# Altium project ICE_DfMux_QC.PrjPcb
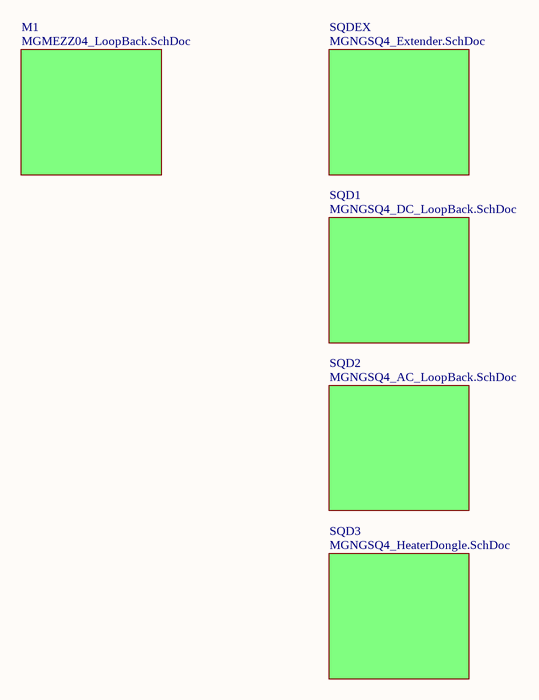
[diagram p0: ListOfDongles.SchDoc]
8 sheets, 82 parts. Net scope: flat (ports and power ports of the same name join across sheets).
Board file: ICE_DfMux_QC.PcbDoc
Sheets:
  ListOfDongles.SchDoc
    SQD3 = MGNGSQ4_HeaterDongle.SchDoc
    M1 = MGMEZZ04_LoopBack.SchDoc
    SQD2 = MGNGSQ4_AC_Loopback.SchDoc
      AC = Transformer.SchDoc
      AC = Transformer.SchDoc
      AC = Transformer.SchDoc
      AC = Transformer.SchDoc
    SQDEX = MGNGSQ4_Extender.SchDoc
    SQD1 = MGNGSQ4_DC_Loopback.SchDoc
      DC = Resistor.SchDoc
      DC = Resistor.SchDoc
      DC = Resistor.SchDoc
      DC = Resistor.SchDoc

## Sheet ListOfDongles.SchDoc
size A

### Sub-sheets
M1 = MGMEZZ04_LoopBack.SchDoc: no entries
SQD1 = MGNGSQ4_DC_LoopBack.SchDoc: no entries
SQD2 = MGNGSQ4_AC_LoopBack.SchDoc: no entries
SQD3 = MGNGSQ4_HeaterDongle.SchDoc: no entries
SQDEX = MGNGSQ4_Extender.SchDoc: no entries

## Sheet MGNGSQ4_HeaterDongle.SchDoc
size A
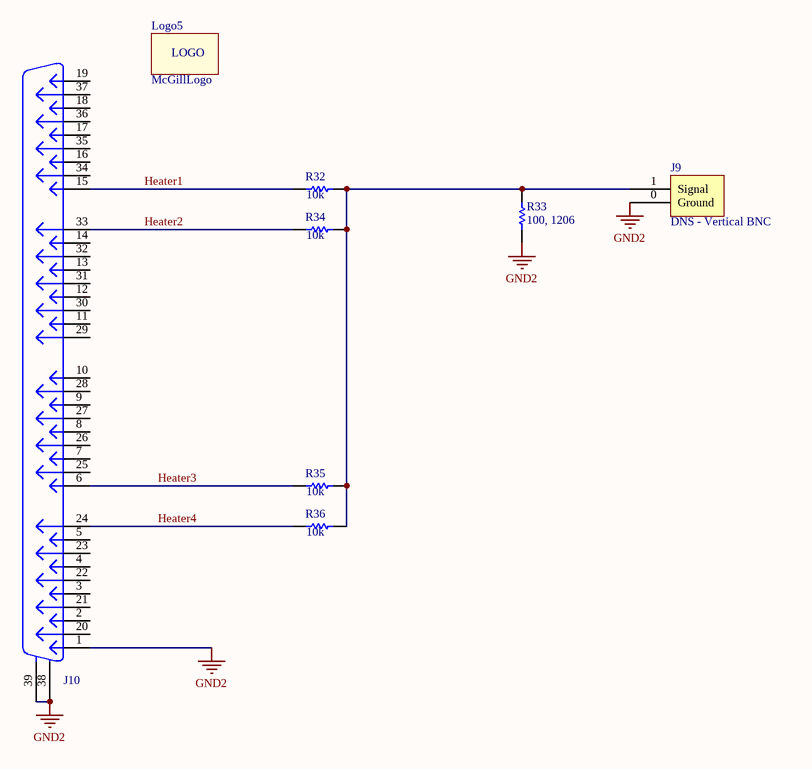
[diagram p1: MGNGSQ4_HeaterDongle.SchDoc]

### Parts
J9  DNS - Vertical BNC  [BNCVert]
J10  DB37M  [DSUB37-M]  (value not drawn)
Logo5  McGillLogo  [McGillLogo1]  (no BOM)
R32  10k  [0603]
R33  100, 1206  [1206]
R34  10k  [0603]
R35  10k  [0603]
R36  10k  [0603]

### Nets
GND2: J9.0(Ground) J10.1 J10.38(MH1) J10.39(MH2) R33.1
Heater1: J10.15 R32.1
Heater2: J10.33 R34.1
Heater3: J10.6 R35.1
Heater4: J10.24 R36.1
NetJ9_1: J9.1(Signal) R32.2 R33.2 R34.2 R35.2 R36.2

Not connected (* = marked no-connect by the designer): J10 2 3 4 5 7 8 9 10 11 12 13 14 16 17 18 19 20 21 22 23 25 26 27 28 29 30 31 32 34 35 36 37

### Notes on the sheet
- (in symbol Logo) LOGO

### Library data of the parts
J9 = BNCVertical: Vertical BNC; Manufacturer: TE Connectivity AMP Connectors; Manufacturer Part Number: 5-1634503-1; Assembly Comments: none; Value: 5-1634503-1; Supplier: Digikey; Cost: $2.79; Part Constraints: 5-1634503-1; Supplier Part Number: A97581-ND; Type: DNS
J10 = DB37M: Manufacturer: Norcomp; Part Constraints: 182-037-113R531; Assembly Comments: none; Cost: $4.32; Manufacturer Part Number: 182-037-113R531; Supplier: Digikey; Supplier Part Number: 182-37ME-ND; Value: DB37M; Type: thru-hole
Logo5 = Logo: Silkscreen Logo; Manufacturer: McGill; Assembly Comments: none; Value: McGillLogo; Cost: $0; Type: SMD
R32 R34-R36 = RES 0603: 10k Ohm RES 0603; Manufacturer: Vishay Dale; Part Constraints: RES 10k OHM 1/10W 1% 0603 SMD; Manufacturer Part Number: CRCW060310K0FKEA; Assembly Comments: none; Value: 10k; Cost: $0.124; Supplier: Digikey; Supplier Part Number: 541-10.0KHCT-ND; Type: SMD
R33 = RES 1206: 100 Ohm RES 1/4W 1206 SMD; Manufacturer: Rohm Semiconductor; Part constraints: 100 Ohm, 1206, 100ppm, 1%, 1/3W; Manufacturer Part Number: ESR18EZPF1000; Value: 100; Assembly Comments: none; Supplier: Digikey; Cost: $0.21; Supplier Part Number: RHM100AFCT-ND; Type: SMD

## Sheet MGMEZZ04_LoopBack.SchDoc
size Letter
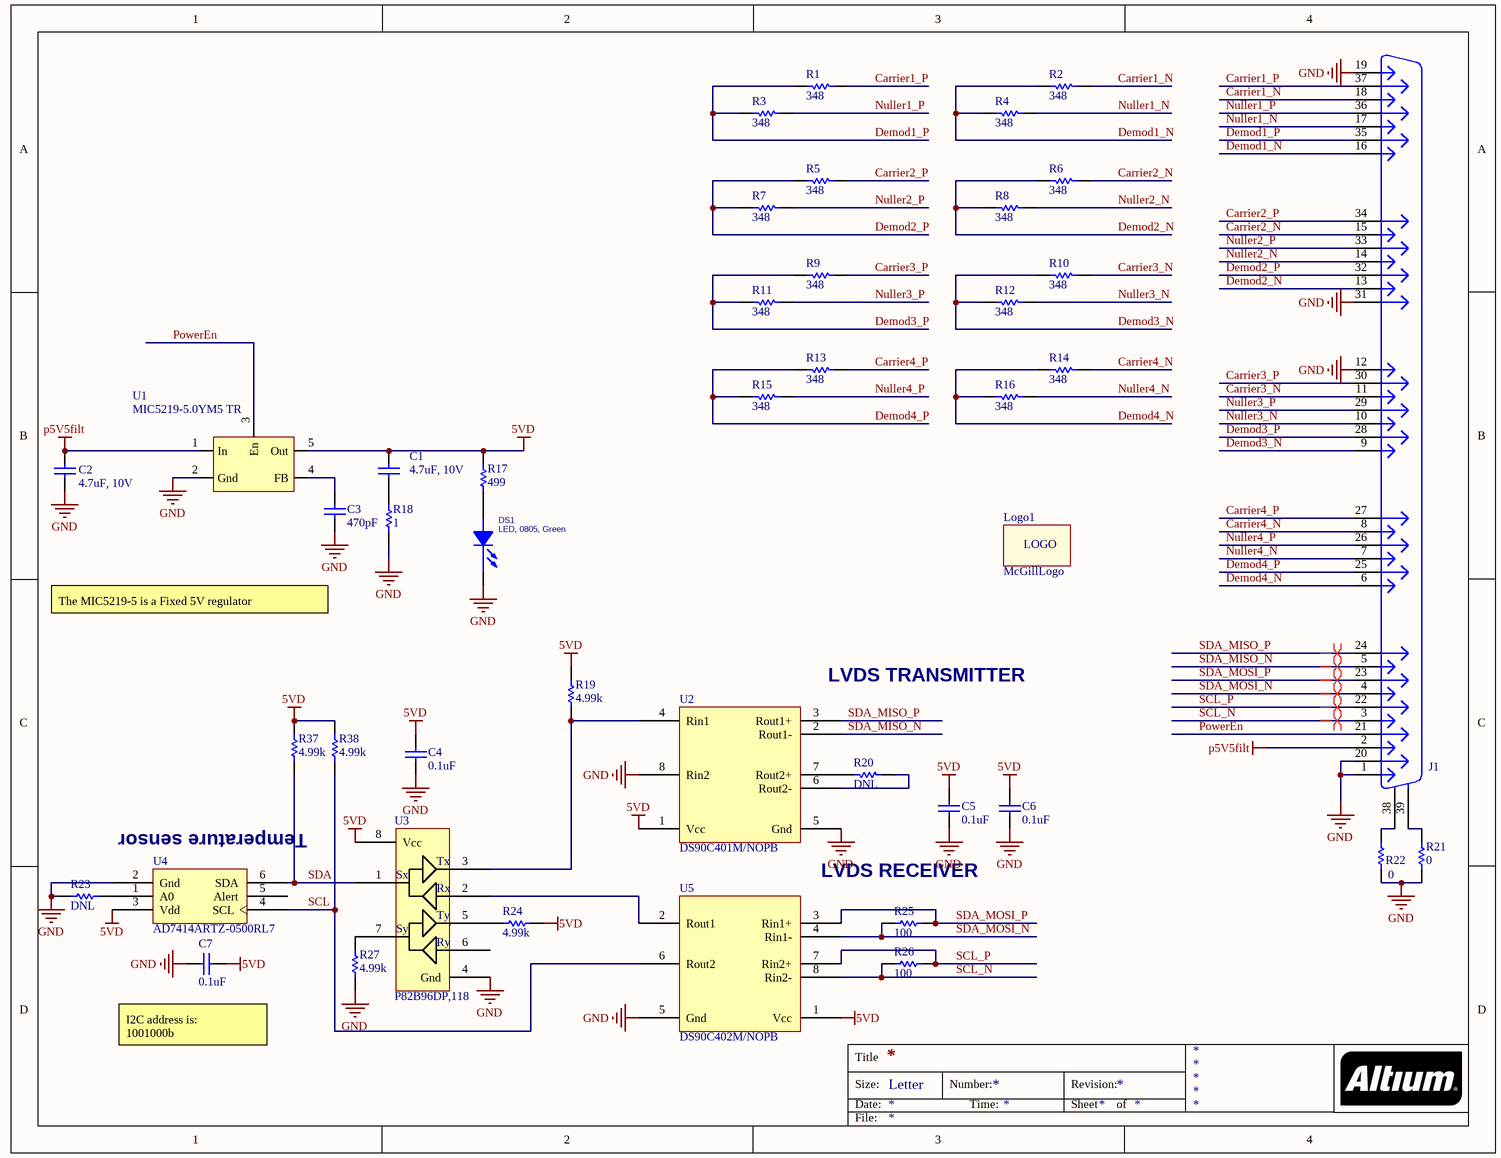
[diagram p2: MGMEZZ04_LoopBack.SchDoc]

### Parts
C1  4.7uF, 10V  [0805]
C2  4.7uF, 10V  [0805]
C3  470pF  [0603]
C4  0.1uF  [0603]
C5  0.1uF  [0603]
C6  0.1uF  [0603]
C7  0.1uF  [0603]
DS1  LED, 0805, Green  [0805L]
J1  DB37M  [DSUB37-M]  (value not drawn)
Logo1  McGillLogo  [McGillLogo1]  (no BOM)
R1  348  [0603]
R2  348  [0603]
R3  348  [0603]
R4  348  [0603]
R5  348  [0603]
R6  348  [0603]
R7  348  [0603]
R8  348  [0603]
R9  348  [0603]
R10  348  [0603]
R11  348  [0603]
R12  348  [0603]
R13  348  [0603]
R14  348  [0603]
R15  348  [0603]
R16  348  [0603]
R17  499  [0603]
R18  1  [0603]
R19  4.99k  [0603]
R20  DNL  [0603]
R21  0  [0603]
R22  0  [0603]
R23  DNL  [0603]
R24  4.99k  [0603]
R25  100  [0603]
R26  100  [0603]
R27  4.99k  [0603]
R37  4.99k  [0603]
R38  4.99k  [0603]
U1  MIC5219-5.0YM5 TR  [SOT23-5]
U2  DS90C401M/NOPB  [SO8]
U3  P82B96DP,118  [MSOP8-P82B96]
U4  AD7414ARTZ-0500RL7  [SOT23-6]
U5  DS90C402M/NOPB  [SO8]

### Nets
5VD: C1.2 C4.2 C5.2 C6.2 C7.2 R17.1 R19.2 R24.2 R37.2 R38.2 U1.5(Out) U2.1(Vcc) U3.8(Vcc) U4.3(Vdd) U5.1(Vcc)
GND: C2.1 C3.1 C4.1 C5.1 C6.1 C7.1 DS1.2(CATHODE) J1.1 J1.12 J1.19 J1.20 J1.31 R18.1 R21.2 R22.1 R23.2 R27.1 U1.2(Gnd) U2.5(Gnd) U2.8(Rin2) U3.4(Gnd) U4.2(Gnd) U5.5(Gnd)
p5V5filt: C2.2 J1.2 U1.1(In)
Carrier1_N: J1.18 R2.2
Carrier1_P: J1.37 R1.2
Carrier2_N: J1.15 R6.2
Carrier2_P: J1.34 R5.2
Carrier3_N: J1.11 R10.2
Carrier3_P: J1.30 R9.2
Carrier4_N: J1.8 R14.2
Carrier4_P: J1.27 R13.2
Demod1_N: J1.16 R2.1 R4.1
Demod1_P: J1.35 R1.1 R3.1
Demod2_N: J1.13 R6.1 R8.1
Demod2_P: J1.32 R5.1 R7.1
Demod3_N: J1.9 R10.1 R12.1
Demod3_P: J1.28 R9.1 R11.1
Demod4_N: J1.6 R14.1 R16.1
Demod4_P: J1.25 R13.1 R15.1
Nuller1_N: J1.17 R4.2
Nuller1_P: J1.36 R3.2
Nuller2_N: J1.14 R8.2
Nuller2_P: J1.33 R7.2
Nuller3_N: J1.10 R12.2
Nuller3_P: J1.29 R11.2
Nuller4_N: J1.7 R16.2
Nuller4_P: J1.26 R15.2
PowerEn: J1.21 U1.3(En)
SCL: R38.1 U4.4(SCL) U5.6(Rout2)
SCL_N: J1.3 R26.1 U5.8(Rin2-)
SCL_P: J1.22 R26.2 U5.7(Rin2+)
SDA: R37.1 U3.1(Sx) U4.6(SDA)
SDA_MISO_N: J1.5 U2.2(Rout1-)
SDA_MISO_P: J1.24 U2.3(Rout1+)
SDA_MOSI_N: J1.4 R25.1 U5.4(Rin1-)
SDA_MOSI_P: J1.23 R25.2 U5.3(Rin1+)
NetC1_1: C1.1 R18.2
NetC3_2: C3.2 U1.4(FB)
NetDS1_1: DS1.1(ANODE) R17.2
NetJ1_38: J1.38(MH1) R22.2
NetJ1_39: J1.39(MH2) R21.1
NetR19_1: R19.1 U2.4(Rin1) U3.3(Tx)
NetR20_1: R20.1 U2.6(Rout2-)
NetR20_2: R20.2 U2.7(Rout2+)
NetR23_1: R23.1 U4.1(A0)
NetR24_1: R24.1 U3.5(Ty)
NetR27_2: R27.2 U3.7(Sy)
NetU3_2: U3.2(Rx) U5.2(Rout1)

Not connected (* = marked no-connect by the designer): U3 6(Ry); U4 5(Alert)

### Layout directives
differential pair: SCL_N, SCL_P, SDA_MISO_N, SDA_MISO_P, SDA_MOSI_N, SDA_MOSI_P

### Notes on the sheet
- The MIC5219-5 is a Fixed 5V regulator
- (near U2) LVDS TRANSMITTER
- (near U4) Temperature sensor
- LVDS RECEIVER
- (near C7) I2C address is:
  1001000b
- Labels drawn without touching a wire or pin: SCL
- Title
- Size:
- Date:
- Letter
- Number:
- Time:
- Revision:
- Sheet
- of
- File:
- (in symbol Logo) LOGO

### Library data of the parts
C1 C2 = CAP 0805: 4.7uF 10V Capacitor, Ceramic, 0805; Manufacturer: Taiyo Yuden; Part Constraints: LMK212BJ475KD-T; Assembly Comments: none; Type: SMD; Value: 4.7uF, 10V; Supplier: Digikey; Supplier Part Number: 587-1297-1-ND; Manufacturer Part Number: LMK212BJ475KD-T; Cost: $0.24
C3 = Cap0603: 470pF Capacitor, Ceramic, 0603; Part Constraints: 470pF 50V 10% X7R 0603; Manufacturer: Kemet; Manufacturer Part Number: C0603C471K5RACTU; Assembly Comments: none; Type: SMD; Value: 470pF; Supplier: Digikey; Supplier Part Number: 399-1075-1-ND; Cost: $0.14
C4-C7 = Cap0603: 0.1uF 0603 Ceramic Capacitor; Part Constraints: 0.1uF 16V 10% X7R; Manufacturer: Kemet; Manufacturer Part Number: C0603C104K4RACTU; Assembly Comments: none; Type: SMD; Value: 0.1uF; Supplier: Digikey; Supplier Part Number: 399-1096-1-ND; Cost: $0.14
DS1 = LED: LED GREEN CLEAR 0805 SMD; Manufacturer: Lite-On Inc; Part constraints: Green LED 0805 2.1V forward voltage 6mcd 10mA; Manufacturer Part Number: LTST-C170GKT; Assembly Comments: none; Supplier: Digikey; Supplier Part Number: 160-1179-1-ND; Value: LED, 0805, Green; Cost: $0.49; Type: SMD
J1 = DB37M: as J10 on sheet MGNGSQ4_HeaterDongle; Supplier: Digikey; Supplier Part Number: 182-37ME-ND; Value: DB37M; Manufacturer Part Number: 182-037-113R531; Cost: $4.32; Type: thru-hole
Logo1 = Logo: as Logo5 on sheet MGNGSQ4_HeaterDongle; Value: McGillLogo; Cost: $0; Type: SMD
R1-R16 = Res0603: 348 Ohm RES 0603; Manufacturer: Vishay Dale; Part constraints: RES 348 OHM 1/10W 1% 0603 SMD; Manufacturer Part Number: CRCW0603348RFKEA; Assembly Comments: none; Value: 348; Supplier: Digikey; Supplier Part Number: 541-348HCT-ND; Cost: $0.124; Type: SMD
R17 = RES 0603: 499 Ohm RES 0603; Manufacturer: Vishay Dale; Part constraints: RES 499 OHM 1/10W 1% 0603 SMD; Manufacturer Part Number: CRCW0603499RFKEA; Assembly Comments: none; Value: 499; Supplier: Digikey; Supplier Part Number: 541-499HCT-ND; Cost: $0.124; Type: SMD
R18 = Res0603: 1 Ohm RES 0603; Manufacturer: Vishay Dale; Part constraints: RES 1 OHM 1/10W 1% 0603 SMD; Manufacturer Part Number: CRCW06031R00FKEA; Assembly Comments: none; Value: 1; Supplier: Digikey; Supplier Part Number: 541-1.00HHCT-ND; Cost: $0.124; Type: SMD
R19 R24 R27 R37 R38 = Res0603: 4.99k Ohm RES 0603; Manufacturer: Vishay Dale; Part constraints: RES 4.99K OHM 1/10W 1% 0603 SMD; Manufacturer Part Number: CRCW06034K99FKEA; Assembly Comments: none; Value: 4.99k; Supplier: Digikey; Supplier Part Number: 541-4.99KHCT-ND; Cost: $0.124; Type: SMD
R20 R23 = Res0603: DO NOT LOAD (DNS); Manufacturer: Generic; Assembly Comments: none; Value: DNL; Part constraints: DNL; Supplier: Digikey; Manufacturer Part Number: DNL; Cost: $0; Type: DNS
R21 R22 = RES 0603: 0 Ohm RES 0603; Manufacturer: Vishay Dale; Part constraints: 0 1/10W 1% 100ppm/C 0603; Manufacturer Part Number: CRCW06030000Z0EA; Assembly Comments: none; Value: 0; Supplier: Digikey; Supplier Part Number: 541-0.0GCT-ND; Cost: $0.114; Type: SMD
R25 R26 = RES 0603: 100 Ohm RES 0603; Manufacturer: Vishay Dale; Part constraints: RES 100 OHM 1/10W 1% 0603 SMD; Manufacturer Part Number: CRCW0603100RFKEA; Assembly Comments: none; Value: 100; Supplier: Digikey; Supplier Part Number: 541-100HCT-ND; Cost: $0.124; Type: SMD
U1 = TPS73601DBVR: Adjustable 30uVrms noise 400mA regulator; Manufacturer: Micrel Inc; Assembly Comments: none; Part Constraints: MIC5219-5.0YM5 TR; Supplier: Digikey; Supplier Part Number: 576-2770-1-ND; Value: MIC5219-5.0YM5 TR; Manufacturer Part Number: MIC5219-5.0YM5 TR; Cost: $2.62; Type: SMD
U2 = DS90C401M/NOPB: IC DRV LVDS DUAL DIFF SGNL 8SOIC; Manufacturer: Texas Instruments; Part Constraints: DS90C401MX/NOPB; Assembly Comments: none; Supplier: Digikey; Supplier Part Number: DS90C401M/NOPB-ND; Value: DS90C401M/NOPB; Manufacturer Part Number: DS90C401MX/NOPB; Cost: $4.64; Type: SMD
U3 = P82B96: IC DUAL BI-DIR BUS BUFFER 8-TSSOP; Assembly Comments: none; Part Constraints: P82B96DP,118; Supplier: Digikey; Supplier Part Number: 568-3197-1-ND; Value: P82B96DP,118; Manufacturer Part Number: P82B96DP,118; Cost: $4.61; Type: SMD
U4 = AD7414ARTZ-0500RL7: Digital Temperature Sensor, 11-Bit, +/-2 Degree Accurate; Manufacturer: Analog Devices; Assembly Comments: none; Footprint: *; Part constraints: AD7414ARTZ-0500RL7; Supplier: Digikey; Supplier Part Number: AD7414ARTZ0500RCT-ND; Value: AD7414ARTZ-0500RL7; Manufacturer Part Number: AD7414ARTZ-0500RL7; Cost: $4.11; Type: SMD
U5 = DS90C402M/NOPB: IC REC LVDS DUAL DIFF SGNL 8SOIC; Manufacturer: Texas Instruments; Part Constraints: DS90C402MX/NOPB; Assembly Comments: none; Supplier: Digikey; Supplier Part Number: DS90C402M/NOPB-ND; Value: DS90C402M/NOPB; Manufacturer Part Number: DS90C402MX/NOPB; Cost: $5.16; Type: SMD

## Sheet MGNGSQ4_AC_Loopback.SchDoc
size A
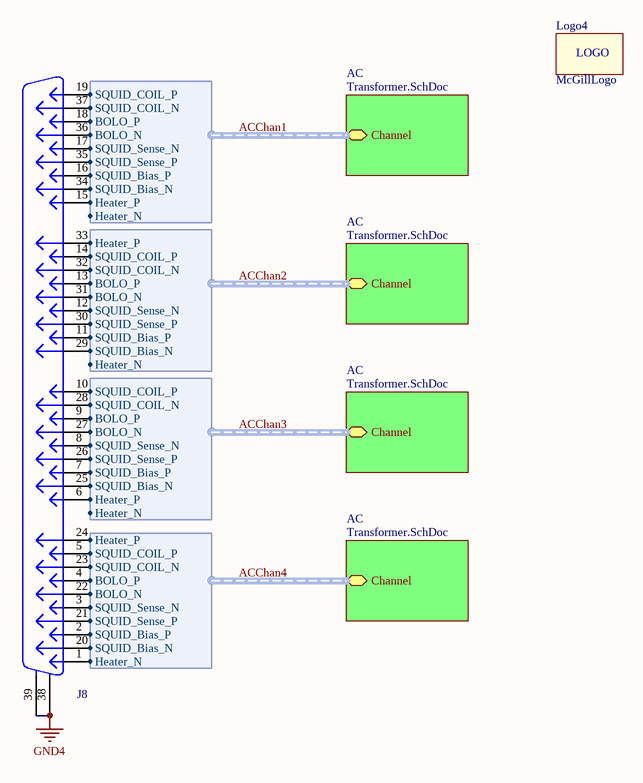
[diagram p3: MGNGSQ4_AC_Loopback.SchDoc]

### Parts
J8  DB37M  [DSUB37-M]  (value not drawn)
Logo4  McGillLogo  [McGillLogo1]  (no BOM)

### Sub-sheets
AC = Transformer.SchDoc: Channel (harness SQUID_CH_IN)
AC = Transformer.SchDoc: Channel (harness SQUID_CH_IN)
AC = Transformer.SchDoc: Channel (harness SQUID_CH_IN)
AC = Transformer.SchDoc: Channel (harness SQUID_CH_IN)

### Harnesses
SQUID_CH_IN: SQUID_COIL_P, SQUID_COIL_N, BOLO_P, BOLO_N, SQUID_Sense_P, SQUID_Bias_P, SQUID_Bias_N, Heater_P, SQUID_Sense_N, Heater_N

### Nets
GND4: J8.38(MH1) J8.39(MH2)
ACChan1.BOLO_N: J8.36 ; sheet AC/Channel.BOLO_N
ACChan1.BOLO_P: J8.18 ; sheet AC/Channel.BOLO_P
ACChan1.Heater_P: J8.15 ; sheet AC/Channel.Heater_P
ACChan1.SQUID_Bias_N: J8.34 ; sheet AC/Channel.SQUID_Bias_N
ACChan1.SQUID_Bias_P: J8.16 ; sheet AC/Channel.SQUID_Bias_P
ACChan1.SQUID_COIL_N: J8.37 ; sheet AC/Channel.SQUID_COIL_N
ACChan1.SQUID_COIL_P: J8.19 ; sheet AC/Channel.SQUID_COIL_P
ACChan1.SQUID_Sense_N: J8.17 ; sheet AC/Channel.SQUID_Sense_N
ACChan1.SQUID_Sense_P: J8.35 ; sheet AC/Channel.SQUID_Sense_P
ACChan2.BOLO_N: J8.31 ; sheet AC/Channel.BOLO_N
ACChan2.BOLO_P: J8.13 ; sheet AC/Channel.BOLO_P
ACChan2.Heater_P: J8.33 ; sheet AC/Channel.Heater_P
ACChan2.SQUID_Bias_N: J8.29 ; sheet AC/Channel.SQUID_Bias_N
ACChan2.SQUID_Bias_P: J8.11 ; sheet AC/Channel.SQUID_Bias_P
ACChan2.SQUID_COIL_N: J8.32 ; sheet AC/Channel.SQUID_COIL_N
ACChan2.SQUID_COIL_P: J8.14 ; sheet AC/Channel.SQUID_COIL_P
ACChan2.SQUID_Sense_N: J8.12 ; sheet AC/Channel.SQUID_Sense_N
ACChan2.SQUID_Sense_P: J8.30 ; sheet AC/Channel.SQUID_Sense_P
ACChan3.BOLO_N: J8.27 ; sheet AC/Channel.BOLO_N
ACChan3.BOLO_P: J8.9 ; sheet AC/Channel.BOLO_P
ACChan3.Heater_P: J8.6 ; sheet AC/Channel.Heater_P
ACChan3.SQUID_Bias_N: J8.25 ; sheet AC/Channel.SQUID_Bias_N
ACChan3.SQUID_Bias_P: J8.7 ; sheet AC/Channel.SQUID_Bias_P
ACChan3.SQUID_COIL_N: J8.28 ; sheet AC/Channel.SQUID_COIL_N
ACChan3.SQUID_COIL_P: J8.10 ; sheet AC/Channel.SQUID_COIL_P
ACChan3.SQUID_Sense_N: J8.8 ; sheet AC/Channel.SQUID_Sense_N
ACChan3.SQUID_Sense_P: J8.26 ; sheet AC/Channel.SQUID_Sense_P
ACChan4.BOLO_N: J8.22 ; sheet AC/Channel.BOLO_N
ACChan4.BOLO_P: J8.4 ; sheet AC/Channel.BOLO_P
ACChan4.Heater_N: J8.1 ; sheet AC/Channel.Heater_N
ACChan4.Heater_P: J8.24 ; sheet AC/Channel.Heater_P
ACChan4.SQUID_Bias_N: J8.20 ; sheet AC/Channel.SQUID_Bias_N
ACChan4.SQUID_Bias_P: J8.2 ; sheet AC/Channel.SQUID_Bias_P
ACChan4.SQUID_COIL_N: J8.23 ; sheet AC/Channel.SQUID_COIL_N
ACChan4.SQUID_COIL_P: J8.5 ; sheet AC/Channel.SQUID_COIL_P
ACChan4.SQUID_Sense_N: J8.3 ; sheet AC/Channel.SQUID_Sense_N
ACChan4.SQUID_Sense_P: J8.21 ; sheet AC/Channel.SQUID_Sense_P

### Buses and harness runs
harness ACChan1 = sheet AC/Channel
harness ACChan2 = sheet AC/Channel
harness ACChan3 = sheet AC/Channel
harness ACChan4 = sheet AC/Channel

### Notes on the sheet
- (in symbol Logo) LOGO

### Library data of the parts
J8 = DB37M: as J10 on sheet MGNGSQ4_HeaterDongle; Cost: $4.32; Manufacturer Part Number: 182-037-113R531; Supplier: Digikey; Supplier Part Number: 182-37ME-ND; Value: DB37M; Type: thru-hole
Logo4 = Logo: as Logo5 on sheet MGNGSQ4_HeaterDongle; Value: McGillLogo; Cost: $0; Type: SMD

## Sheet Transformer.SchDoc
size A
Used 4 times, as channels SQD2/AC, SQD2/AC, SQD2/AC, SQD2/AC. Parts and nets are listed once, with the designators drawn on the sheet.
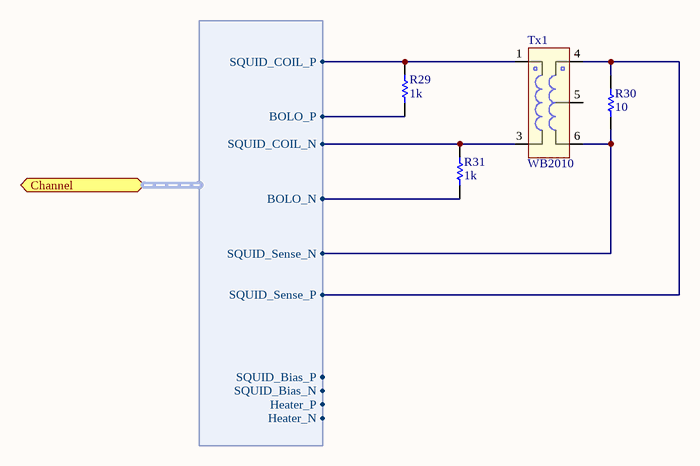
[diagram p4: Transformer.SchDoc]

### Parts
R29  1k  [0603]
R30  10  [0603]
R31  1k  [0603]
Tx1  WB2010  [WB2010]

### Ports
Channel (harness SQUID_CH_IN)

### Harnesses
SQUID_CH_IN: SQUID_COIL_P, SQUID_COIL_N, BOLO_P, BOLO_N, SQUID_Sense_P, SQUID_Bias_P, SQUID_Bias_N, Heater_P, SQUID_Sense_N, Heater_N

### Nets
NetR29_1: R29.1 ; port Channel.BOLO_P
NetR29_2: R29.2 Tx1.1 ; port Channel.SQUID_COIL_P
NetR30_1: R30.1 Tx1.6 ; port Channel.SQUID_Sense_N
NetR30_2: R30.2 Tx1.4 ; port Channel.SQUID_Sense_P
NetR31_1: R31.1 ; port Channel.BOLO_N
NetR31_2: R31.2 Tx1.3 ; port Channel.SQUID_COIL_N

Not connected (* = marked no-connect by the designer): Tx1 5

### Channels
SQD2/AC: designators end in _AC4
SQD2/AC: designators end in _AC3
SQD2/AC: designators end in _AC2
SQD2/AC: designators end in _AC1

### Library data of the parts
R29 R31 = RES 0603: 1k RES 0603; Manufacturer: Vishay Dale; Part Constraints: RES 1k OHM 1/10W 1% 0603 SMD; Manufacturer Part Number: CRCW06031K00FKEA; Assembly Comments: none; Value: 1k; Cost: $0.124; Supplier: Digikey; Supplier Part Number: 541-1.00KHCT-ND; Type: SMD
R30 = RES 0603: 10 Ohm RES 0603; Manufacturer: Vishay Dale; Part Constraints: RES 10 OHM 1/10W 1% 0603 SMD; Manufacturer Part Number: CRCW060310R0FKEA; Assembly Comments: none; Value: 10; Cost: $0.124; Supplier: Digikey; Supplier Part Number: 541-10.0HCT-ND; Type: SMD
Tx1 = WB2010: WB2010 1:1 Transformer; Manufacturer: Coilcraft; Manufacturer Part Number: WB2010-SMLB; Assembly Comments: none; Value: WB2010-SMLB; Supplier: Coilcraft; Cost: $4.16; Part Constraints: WB2010-SMLB; Supplier Part Number: WB2010-SMLB; Type: SMD

## Sheet MGNGSQ4_Extender.SchDoc
size A
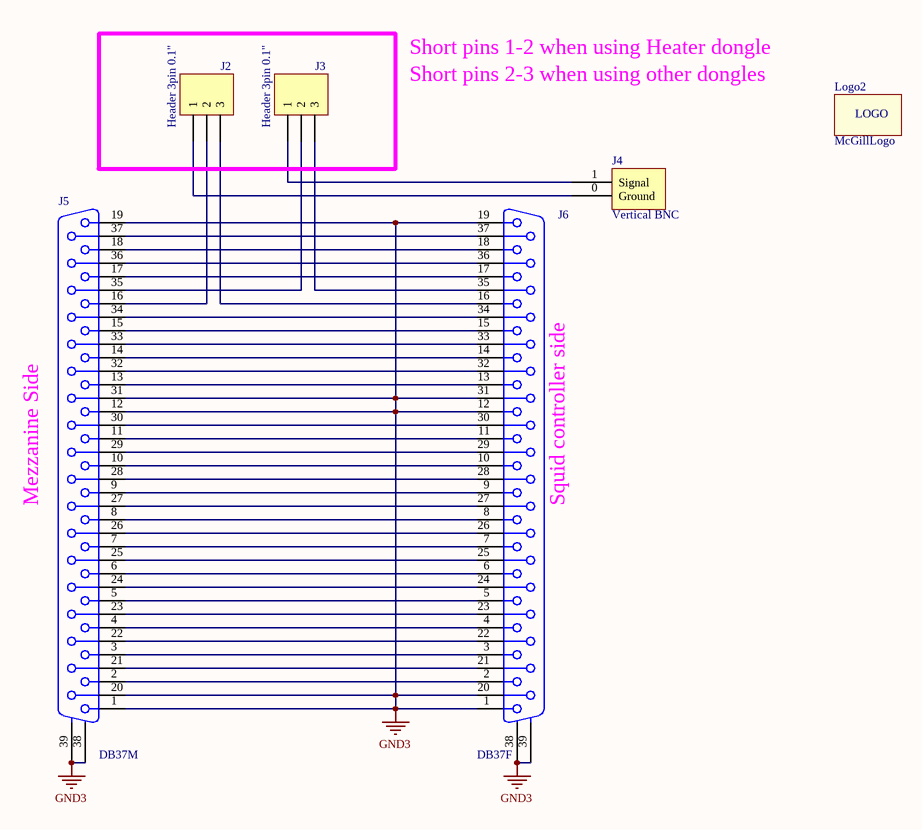
[diagram p5: MGNGSQ4_Extender.SchDoc]

### Parts
J2  Header 3pin 0.1"  [HDR1X3]
J3  Header 3pin 0.1"  [HDR1X3]
J4  Vertical BNC  [BNCVert]
J5  DB37M  [DSUB37-M]
J6  DB37F  [DSUB37-F]
Logo2  McGillLogo  [McGillLogo1]  (no BOM)

### Nets
GND3: J5.1 J5.12 J5.19 J5.20 J5.31 J5.38(MH1) J5.39(MH2) J6.1 J6.12 J6.19 J6.20 J6.31 J6.38(MH1) J6.39(MH2)
NetJ2_1: J2.1 J4.0(Ground)
NetJ2_2: J2.2 J5.16
NetJ2_3: J2.3 J6.16
NetJ3_1: J3.1 J4.1(Signal)
NetJ3_2: J3.2 J5.35
NetJ3_3: J3.3 J6.35
NetJ5_2: J5.2 J6.2
NetJ5_3: J5.3 J6.3
NetJ5_4: J5.4 J6.4
NetJ5_5: J5.5 J6.5
NetJ5_6: J5.6 J6.6
NetJ5_7: J5.7 J6.7
NetJ5_8: J5.8 J6.8
NetJ5_9: J5.9 J6.9
NetJ5_10: J5.10 J6.10
NetJ5_11: J5.11 J6.11
NetJ5_13: J5.13 J6.13
NetJ5_14: J5.14 J6.14
NetJ5_15: J5.15 J6.15
NetJ5_17: J5.17 J6.17
NetJ5_18: J5.18 J6.18
NetJ5_21: J5.21 J6.21
NetJ5_22: J5.22 J6.22
NetJ5_23: J5.23 J6.23
NetJ5_24: J5.24 J6.24
NetJ5_25: J5.25 J6.25
NetJ5_26: J5.26 J6.26
NetJ5_27: J5.27 J6.27
NetJ5_28: J5.28 J6.28
NetJ5_29: J5.29 J6.29
NetJ5_30: J5.30 J6.30
NetJ5_32: J5.32 J6.32
NetJ5_33: J5.33 J6.33
NetJ5_34: J5.34 J6.34
NetJ5_36: J5.36 J6.36
NetJ5_37: J5.37 J6.37

### Notes on the sheet
- Short pins 1-2 when using Heater dongle
- (near Logo2) Short pins 2-3 when using other dongles
- (near J5) Mezzanine Side
- (near J6) Squid controller side
- (in symbol Logo) LOGO

### Library data of the parts
J2 J3 = Header3: Header, 0.1", 3-Pin straight; Manufacturer: Digikey; Manufacturer Part Number: 961103-6404-AR; Part Constraints: 3 pin 100mil header; Assembly Comments: none; Footprint: *; Supplier: Digikey; Cost: $0.37; Supplier Part Number: 3M9448-ND; Type: thru-hole
J4 = BNCVertical: Manufacturer: TE Connectivity AMP Connectors; Manufacturer Part Number: 5-1634503-1; Assembly Comments: none; Value: 5-1634503-1; Supplier: Digikey; Cost: $2.79; Part Constraints: 5-1634503-1; Supplier Part Number: A97581-ND; Type: thru-hole
J5 = DB37M: as J10 on sheet MGNGSQ4_HeaterDongle; Cost: $4.32; Manufacturer Part Number: 182-037-113R531; Supplier: Digikey; Supplier Part Number: 182-37ME-ND; Value: DB37M; Type: thru-hole
J6 = DB37F: Manufacturer: Norcomp; Part Constraints: 182-037-213R181; Assembly Comments: none; Cost: $4.97; Manufacturer Part Number: 182-037-213R181; Supplier: Digikey; Supplier Part Number: 182-837FE-ND; Value: DB37F; Type: thru-hole
Logo2 = Logo: as Logo5 on sheet MGNGSQ4_HeaterDongle; Value: McGillLogo; Cost: $0; Type: SMD

## Sheet MGNGSQ4_DC_Loopback.SchDoc
size A
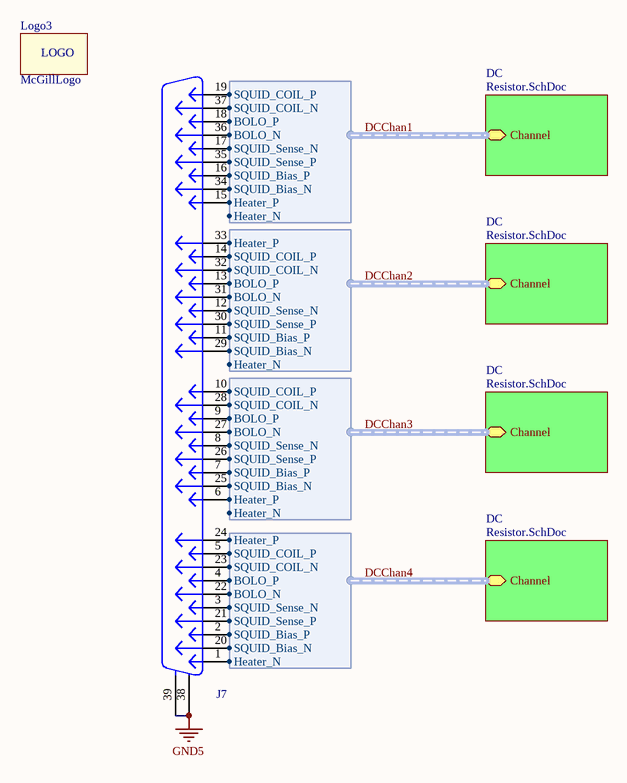
[diagram p6: MGNGSQ4_DC_Loopback.SchDoc]

### Parts
J7  DB37M  [DSUB37-M]  (value not drawn)
Logo3  McGillLogo  [McGillLogo1]  (no BOM)

### Sub-sheets
DC = Resistor.SchDoc: Channel (harness SQUID_CH_IN)
DC = Resistor.SchDoc: Channel (harness SQUID_CH_IN)
DC = Resistor.SchDoc: Channel (harness SQUID_CH_IN)
DC = Resistor.SchDoc: Channel (harness SQUID_CH_IN)

### Harnesses
SQUID_CH_IN: SQUID_COIL_P, SQUID_COIL_N, BOLO_P, BOLO_N, SQUID_Sense_P, SQUID_Bias_P, SQUID_Bias_N, Heater_P, SQUID_Sense_N, Heater_N

### Nets
GND5: J7.38(MH1) J7.39(MH2)
DCChan1.BOLO_N: J7.36 ; sheet DC/Channel.BOLO_N
DCChan1.BOLO_P: J7.18 ; sheet DC/Channel.BOLO_P
DCChan1.Heater_P: J7.15 ; sheet DC/Channel.Heater_P
DCChan1.SQUID_Bias_N: J7.34 ; sheet DC/Channel.SQUID_Bias_N
DCChan1.SQUID_Bias_P: J7.16 ; sheet DC/Channel.SQUID_Bias_P
DCChan1.SQUID_COIL_N: J7.37 ; sheet DC/Channel.SQUID_COIL_N
DCChan1.SQUID_COIL_P: J7.19 ; sheet DC/Channel.SQUID_COIL_P
DCChan1.SQUID_Sense_N: J7.17 ; sheet DC/Channel.SQUID_Sense_N
DCChan1.SQUID_Sense_P: J7.35 ; sheet DC/Channel.SQUID_Sense_P
DCChan2.BOLO_N: J7.31 ; sheet DC/Channel.BOLO_N
DCChan2.BOLO_P: J7.13 ; sheet DC/Channel.BOLO_P
DCChan2.Heater_P: J7.33 ; sheet DC/Channel.Heater_P
DCChan2.SQUID_Bias_N: J7.29 ; sheet DC/Channel.SQUID_Bias_N
DCChan2.SQUID_Bias_P: J7.11 ; sheet DC/Channel.SQUID_Bias_P
DCChan2.SQUID_COIL_N: J7.32 ; sheet DC/Channel.SQUID_COIL_N
DCChan2.SQUID_COIL_P: J7.14 ; sheet DC/Channel.SQUID_COIL_P
DCChan2.SQUID_Sense_N: J7.12 ; sheet DC/Channel.SQUID_Sense_N
DCChan2.SQUID_Sense_P: J7.30 ; sheet DC/Channel.SQUID_Sense_P
DCChan3.BOLO_N: J7.27 ; sheet DC/Channel.BOLO_N
DCChan3.BOLO_P: J7.9 ; sheet DC/Channel.BOLO_P
DCChan3.Heater_P: J7.6 ; sheet DC/Channel.Heater_P
DCChan3.SQUID_Bias_N: J7.25 ; sheet DC/Channel.SQUID_Bias_N
DCChan3.SQUID_Bias_P: J7.7 ; sheet DC/Channel.SQUID_Bias_P
DCChan3.SQUID_COIL_N: J7.28 ; sheet DC/Channel.SQUID_COIL_N
DCChan3.SQUID_COIL_P: J7.10 ; sheet DC/Channel.SQUID_COIL_P
DCChan3.SQUID_Sense_N: J7.8 ; sheet DC/Channel.SQUID_Sense_N
DCChan3.SQUID_Sense_P: J7.26 ; sheet DC/Channel.SQUID_Sense_P
DCChan4.BOLO_N: J7.22 ; sheet DC/Channel.BOLO_N
DCChan4.BOLO_P: J7.4 ; sheet DC/Channel.BOLO_P
DCChan4.Heater_N: J7.1 ; sheet DC/Channel.Heater_N
DCChan4.Heater_P: J7.24 ; sheet DC/Channel.Heater_P
DCChan4.SQUID_Bias_N: J7.20 ; sheet DC/Channel.SQUID_Bias_N
DCChan4.SQUID_Bias_P: J7.2 ; sheet DC/Channel.SQUID_Bias_P
DCChan4.SQUID_COIL_N: J7.23 ; sheet DC/Channel.SQUID_COIL_N
DCChan4.SQUID_COIL_P: J7.5 ; sheet DC/Channel.SQUID_COIL_P
DCChan4.SQUID_Sense_N: J7.3 ; sheet DC/Channel.SQUID_Sense_N
DCChan4.SQUID_Sense_P: J7.21 ; sheet DC/Channel.SQUID_Sense_P

### Buses and harness runs
harness DCChan1 = sheet DC/Channel
harness DCChan2 = sheet DC/Channel
harness DCChan3 = sheet DC/Channel
harness DCChan4 = sheet DC/Channel

### Notes on the sheet
- (in symbol Logo) LOGO

### Library data of the parts
J7 = DB37M: as J10 on sheet MGNGSQ4_HeaterDongle; Cost: $4.32; Manufacturer Part Number: 182-037-113R531; Supplier: Digikey; Supplier Part Number: 182-37ME-ND; Value: DB37M; Type: thru-hole
Logo3 = Logo: as Logo5 on sheet MGNGSQ4_HeaterDongle; Value: McGillLogo; Cost: $0; Type: SMD

## Sheet Resistor.SchDoc
size A
Used 4 times, as channels SQD1/DC, SQD1/DC, SQD1/DC, SQD1/DC. Parts and nets are listed once, with the designators drawn on the sheet.
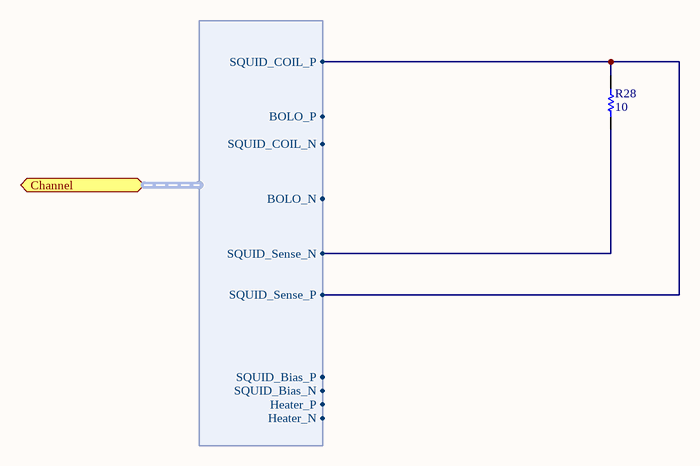
[diagram p7: Resistor.SchDoc]

### Parts
R28  10  [0603]

### Ports
Channel (harness SQUID_CH_IN)

### Harnesses
SQUID_CH_IN: SQUID_COIL_P, SQUID_COIL_N, BOLO_P, BOLO_N, SQUID_Sense_P, SQUID_Bias_P, SQUID_Bias_N, Heater_P, SQUID_Sense_N, Heater_N

### Nets
NetR28_1: R28.1 ; port Channel.SQUID_Sense_N
NetR28_2: R28.2 ; port Channel.SQUID_COIL_P, port Channel.SQUID_Sense_P

### Channels
SQD1/DC: designators end in _DC4
SQD1/DC: designators end in _DC3
SQD1/DC: designators end in _DC2
SQD1/DC: designators end in _DC1

### Library data of the parts
R28 = RES 0603: as R30 on sheet Transformer; Value: 10; Cost: $0.124; Supplier: Digikey; Supplier Part Number: 541-10.0HCT-ND; Type: SMD

## Nets that join several sheets
NetR28_DC1_1: SQD2/AC (R30_AC4.1 Tx1_AC4.6), SQD2/AC (R30_AC3.1 Tx1_AC3.6), SQD2/AC (R30_AC2.1 Tx1_AC2.6), SQD2/AC (R30_AC1.1 Tx1_AC1.6), SQD1/DC (R28_DC4.1), SQD1/DC (R28_DC3.1), SQD1/DC (R28_DC2.1), SQD1/DC (R28_DC1.1)
NetR28_DC1_2: SQD2/AC (R29_AC4.2 R30_AC4.2 Tx1_AC4.1 Tx1_AC4.4), SQD2/AC (R29_AC3.2 R30_AC3.2 Tx1_AC3.1 Tx1_AC3.4), SQD2/AC (R29_AC2.2 R30_AC2.2 Tx1_AC2.1 Tx1_AC2.4), SQD2/AC (R29_AC1.2 R30_AC1.2 Tx1_AC1.1 Tx1_AC1.4), SQD1/DC (R28_DC4.2), SQD1/DC (R28_DC3.2), SQD1/DC (R28_DC2.2), SQD1/DC (R28_DC1.2)
NetR29_AC1_1: SQD2/AC (R29_AC4.1), SQD2/AC (R29_AC3.1), SQD2/AC (R29_AC2.1), SQD2/AC (R29_AC1.1)
NetR31_AC1_1: SQD2/AC (R31_AC4.1), SQD2/AC (R31_AC3.1), SQD2/AC (R31_AC2.1), SQD2/AC (R31_AC1.1)
NetR31_AC1_2: SQD2/AC (R31_AC4.2 Tx1_AC4.3), SQD2/AC (R31_AC3.2 Tx1_AC3.3), SQD2/AC (R31_AC2.2 Tx1_AC2.3), SQD2/AC (R31_AC1.2 Tx1_AC1.3)